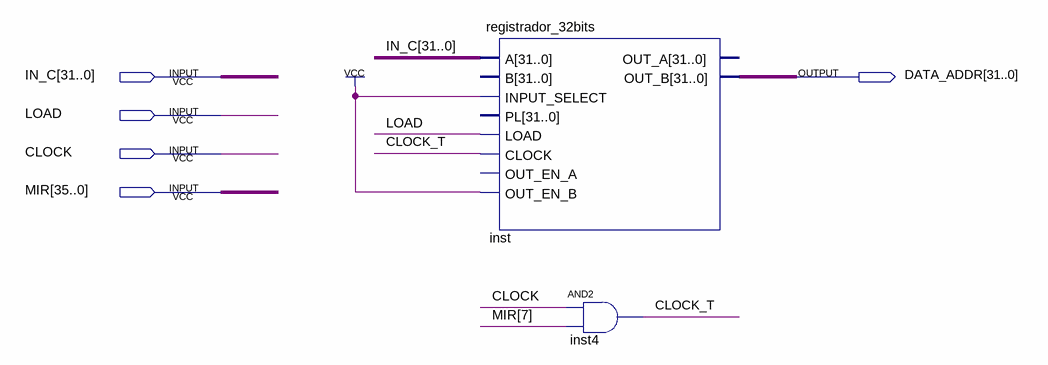
[diagram p0: schematic sheet]
// Quartus schematic MAR.bdf as structural Verilog: 2 symbols, 5 pins
module MAR (
  input  [31:0] IN_C,
  input  LOAD,
  input  CLOCK,
  input  [35:0] MIR,
  output [31:0] DATA_ADDR
);

  wire CLOCK_T;

  registrador_32bits inst (
    .A(IN_C), .INPUT_SELECT(1'b1), .LOAD(LOAD), .CLOCK(CLOCK_T), .OUT_EN_B(1'b1), .OUT_B(DATA_ADDR));  // open: B, PL, OUT_EN_A, OUT_A
  and inst4 (CLOCK_T, CLOCK, MIR[7]);
endmodule
